# Altium schematic sheet Connectors.SchDoc
size A4; SheetNumber: 3; SheetTotal: 4
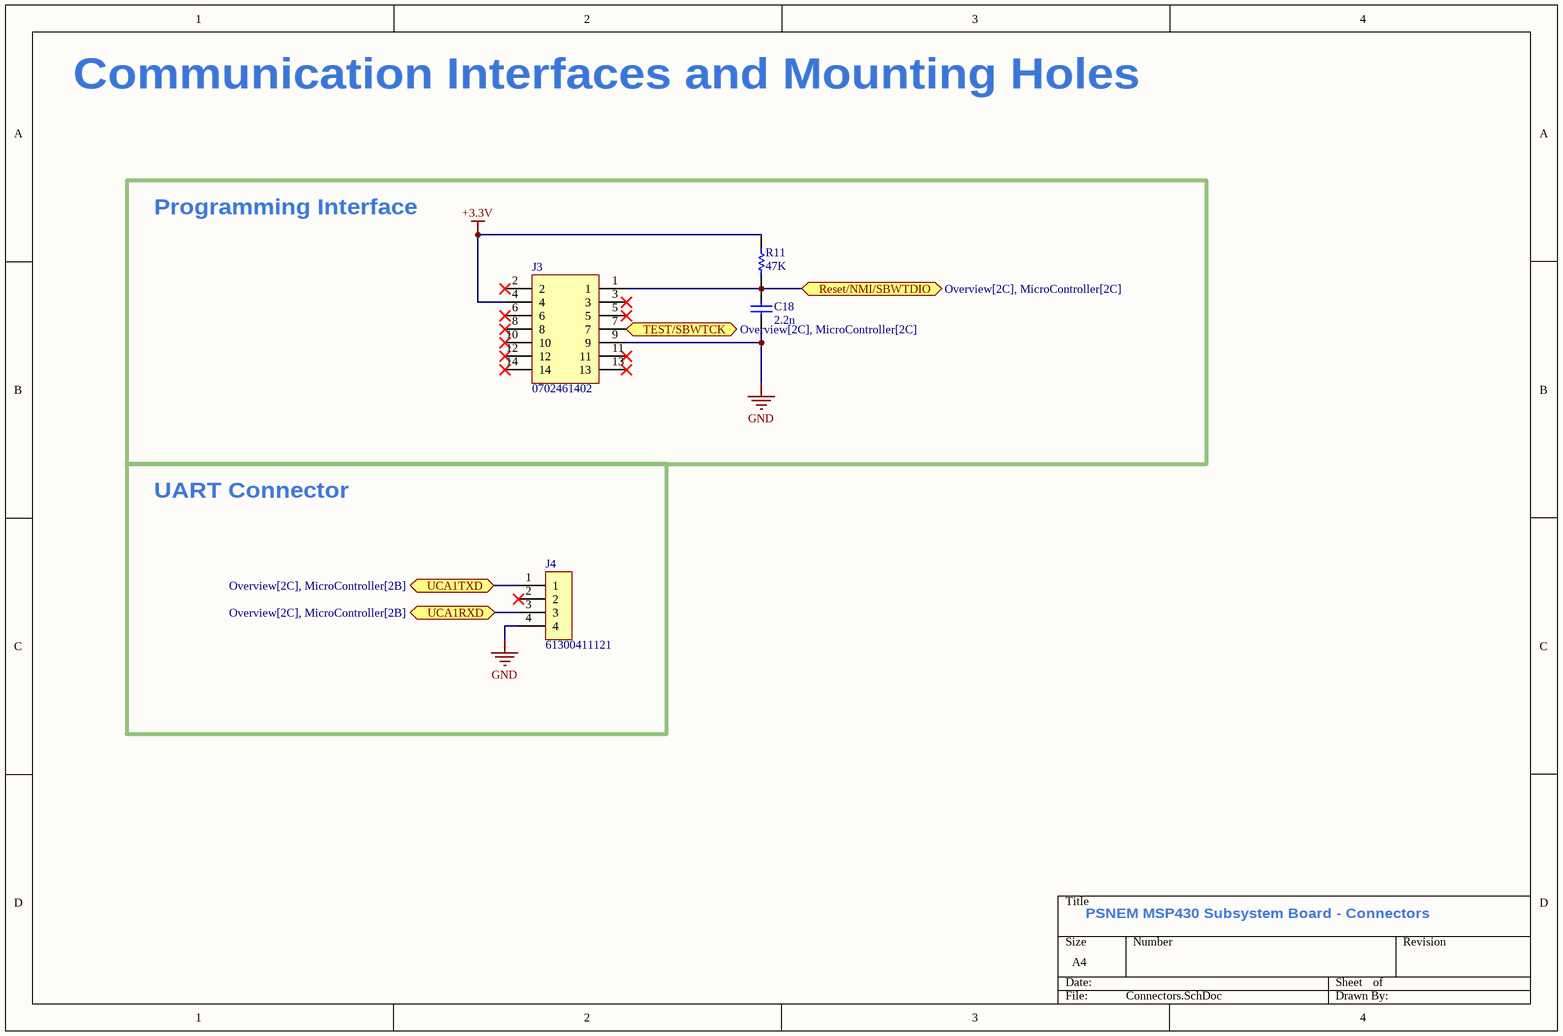
[diagram p0: Connectors.SchDoc]

## Parts
C18  2.2n  [0805 Cap]
J3  0702461402  [0702461402]
J4  61300411121  [61300411121]
R11  47K  [RESC1608X06N]

## Blocks framed on the sheet
Programming Interface: C18 J3 R11
UART Connector: J4

## Ports
Reset/NMI/SBWTDIO (bidir, see Overview[2C], MicroController[2C]), TEST/SBWTCK (bidir, see Overview[2C], MicroController[2C]), UCA1RXD (bidir, see Overview[2C], MicroController[2B]), UCA1TXD (bidir, see Overview[2C], MicroController[2B])

## Nets
+3.3V: J3.4 R11.2
GND: C18.1 J3.9 J4.4
Reset/NMI/SBWTDIO: C18.2 J3.1 R11.1 ; port Reset/NMI/SBWTDIO
TEST/SBWTCK: J3.7 ; port TEST/SBWTCK
UCA1RXD: J4.3 ; port UCA1RXD
UCA1TXD: J4.1 ; port UCA1TXD

Not connected (* = marked no-connect by the designer): J3 2* 3* 5* 6* 8* 10* 11* 12* 13* 14*; J4 2*

## Notes on the sheet
- Communication Interfaces and Mounting Holes
- PSNEM MSP430 Subsystem Board - Connectors

## Library data of the parts
C18 = CC0805KRX7R9BB222: 2200 pF ±10% 50V Ceramic Capacitor X7R 0805 (2012 Metric); value: 2.2n
J3 = 0702461402: Connector Header Through Hole 14 position 0.100" (2.54mm)
J4 = 61300411121: Connector Header Through Hole 4 position 0.100" (2.54mm)
R11 = ERA-3VEB4702V: Thin Film Resistors - SMD 0603 0.1% 47Kohm 25ppm SMD; value: 47K